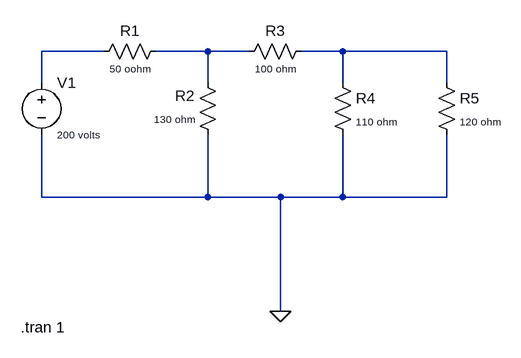
[diagram p0: schematic Draft5.asc]
Draft5.asc, the LTspice schematic file:
Version 4
SHEET 1 880 680
WIRE -16 96 -112 96
WIRE 144 96 64 96
WIRE 208 96 144 96
WIRE 352 96 288 96
WIRE 512 96 352 96
WIRE -112 144 -112 96
WIRE 144 144 144 96
WIRE 352 144 352 96
WIRE 512 144 512 96
WIRE -112 320 -112 224
WIRE 144 320 144 224
WIRE 144 320 -112 320
WIRE 256 320 144 320
WIRE 352 320 352 224
WIRE 352 320 256 320
WIRE 512 320 512 224
WIRE 512 320 352 320
WIRE 256 496 256 320
FLAG 256 496 0
SYMBOL res 80 80 R90
WINDOW 0 0 56 VBottom 2
WINDOW 3 32 56 VTop 1
SYMATTR InstName R1
SYMATTR Value 50 oohm
SYMBOL res 160 240 R180
WINDOW 0 36 76 Left 2
WINDOW 3 36 40 Left 1
SYMATTR InstName R2
SYMATTR Value 130 ohm
SYMBOL res 192 112 R270
WINDOW 0 32 56 VTop 2
WINDOW 3 0 56 VBottom 1
SYMATTR InstName R3
SYMATTR Value 100 ohm
SYMBOL res 336 128 R0
WINDOW 3 36 76 Left 1
SYMATTR Value 110 ohm
SYMATTR InstName R4
SYMBOL res 496 128 R0
WINDOW 3 36 76 Left 1
SYMATTR Value 120 ohm
SYMATTR InstName R5
SYMBOL voltage -112 128 R0
WINDOW 3 24 96 Left 1
SYMATTR Value 200 volts
SYMATTR InstName V1
TEXT -144 520 Left 2 !.tran 1

The netlist it stands for:
* Draft5.asc
R1 N002 N001 50 oohm
R2 0 N002 130 ohm
R3 N002 N003 100 ohm
R4 N003 0 110 ohm
R5 N003 0 120 ohm
V1 N001 0 200 volts
.tran 1
.backanno
.end